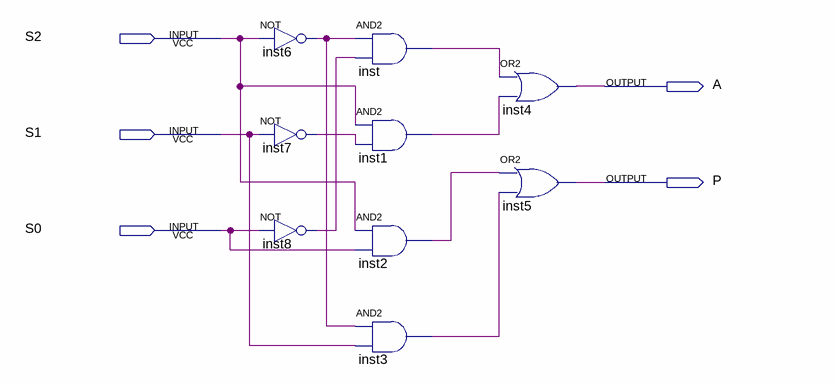
[diagram p0: schematic sheet]
// Quartus schematic lab5AND_OR.bdf as structural Verilog: 9 symbols, 5 pins
module lab5AND_OR (
  input  S2,
  input  S1,
  input  S0,
  output A,
  output P
);

  wire inst1_out, inst2_out, inst3_out, inst6_out, inst7_out, inst8_out, inst_out;

  not inst6 (inst6_out, S2);
  not inst7 (inst7_out, S1);
  not inst8 (inst8_out, S0);
  and inst (inst_out, inst6_out, inst8_out);
  and inst1 (inst1_out, S2, inst7_out);
  and inst2 (inst2_out, S2, S0);
  and inst3 (inst3_out, inst6_out, S1);
  or inst4 (A, inst_out, inst1_out);
  or inst5 (P, inst2_out, inst3_out);
endmodule
